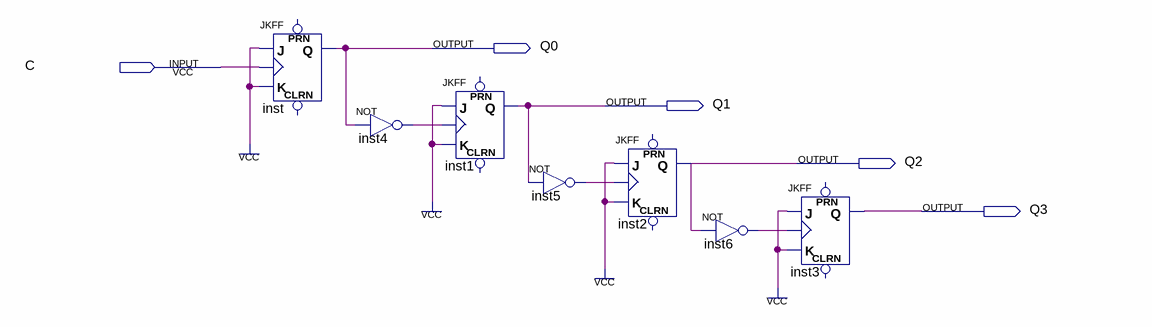
[diagram p0: schematic sheet]
// Quartus schematic lab3.bdf as structural Verilog: 7 symbols, 5 pins
module lab3 (
  input  C,
  output Q0,
  output Q1,
  output Q2,
  output Q3
);

  wire inst4_out, inst5_out, inst6_out;

  JKFF inst (.K(1'b1), .J(1'b1), .CLK(C), .Q(Q0));  // open: PRN, CLRN
  not inst4 (inst4_out, Q0);
  JKFF inst1 (.K(1'b1), .J(1'b1), .CLK(inst4_out), .Q(Q1));  // open: PRN, CLRN
  not inst5 (inst5_out, Q1);
  JKFF inst2 (.K(1'b1), .J(1'b1), .CLK(inst5_out), .Q(Q2));  // open: PRN, CLRN
  not inst6 (inst6_out, Q2);
  JKFF inst3 (.K(1'b1), .J(1'b1), .CLK(inst6_out), .Q(Q3));  // open: PRN, CLRN
endmodule
